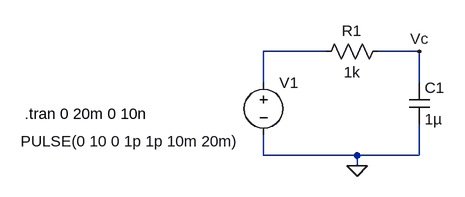
[diagram p0: schematic sim_2.asc]
sim_2.asc, the LTspice schematic file:
Version 4
SHEET 1 880 680
WIRE 128 -240 32 -240
WIRE 272 -240 208 -240
WIRE 32 -192 32 -240
WIRE 272 -192 272 -240
WIRE 32 -80 32 -112
WIRE 176 -80 32 -80
WIRE 272 -80 272 -128
WIRE 272 -80 176 -80
WIRE 176 -64 176 -80
FLAG 176 -64 0
FLAG 272 -240 Vc
SYMBOL voltage 32 -208 R0
WINDOW 3 -374 106 Left 2
WINDOW 123 0 0 Left 0
WINDOW 39 0 0 Left 0
SYMATTR Value PULSE(0 10 0 1p 1p 10m 20m)
SYMATTR InstName V1
SYMBOL res 224 -256 R90
WINDOW 0 0 56 VBottom 2
WINDOW 3 32 56 VTop 2
SYMATTR InstName R1
SYMATTR Value 1k
SYMBOL cap 256 -192 R0
SYMATTR InstName C1
SYMATTR Value 1µ
TEXT -336 -144 Left 2 !.tran 0 20m 0 10n

The netlist it stands for:
* sim_2.asc
V1 N001 0 PULSE(0 10 0 1p 1p 10m 20m)
R1 Vc N001 1k
C1 Vc 0 1µ
.tran 0 20m 0 10n
.backanno
.end